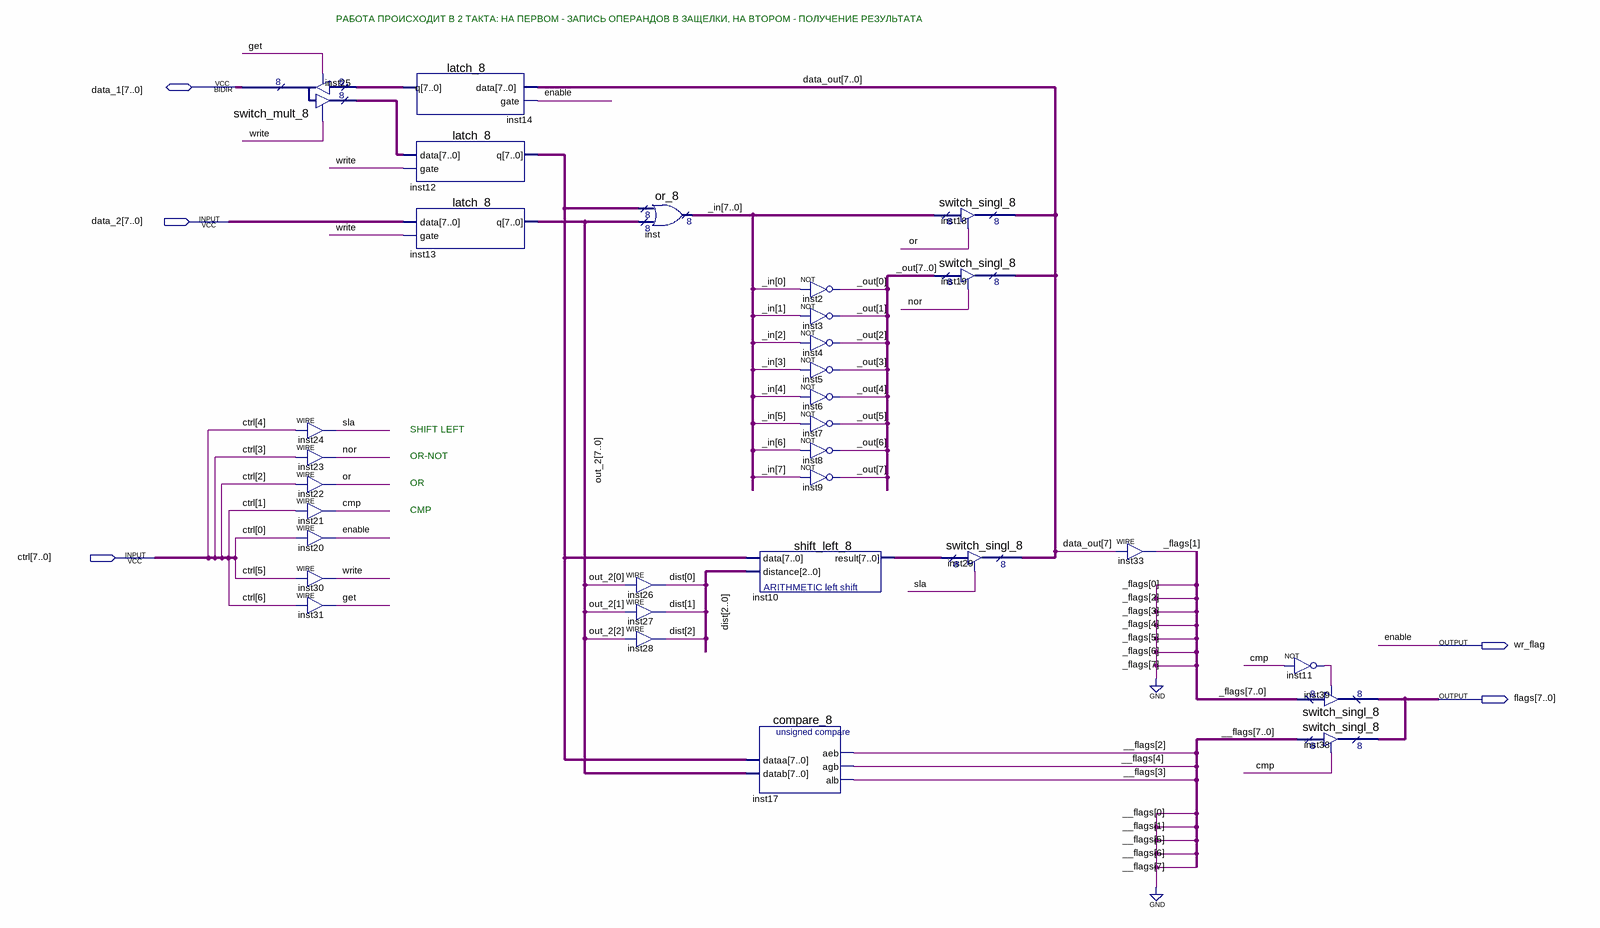
[diagram p0: schematic sheet]
// Quartus schematic alu.bdf as structural Verilog: 32 symbols, 5 pins
module alu (
  input  [7:0] data_2,
  input  [7:0] ctrl,
  inout  [7:0] data_1,
  output wr_flag,
  output [7:0] flags
);

  wire cmp, get, inst11_out, \nor , \or , sla, write;
  wire [1:1] _flags;
  wire [2:0] \dist ;
  wire [4:2] __flags;
  wire [7:0] _in, _out, data_out, inst10_result, inst12_q, inst14_q, inst25_result, out_2;

  switch_mult_8 inst25 (.enabledt(get), .data(inst14_q), .enabletr(write), .result(inst25_result), .tridata(data_1));
  assign sla = ctrl[4];  // WIRE inst24
  assign \nor  = ctrl[3];  // WIRE inst23
  assign \or  = ctrl[2];  // WIRE inst22
  assign cmp = ctrl[1];  // WIRE inst21
  assign wr_flag = ctrl[0];  // WIRE inst20
  assign write = ctrl[5];  // WIRE inst30
  assign get = ctrl[6];  // WIRE inst31
  latch_8 inst14 (.data(data_out), .gate(wr_flag), .q(inst14_q));
  latch_8 inst12 (.data(inst25_result), .gate(write), .q(inst12_q));
  latch_8 inst13 (.data(data_2), .gate(write), .q(out_2));
  assign \dist [0] = out_2[0];  // WIRE inst26
  assign \dist [1] = out_2[1];  // WIRE inst27
  assign \dist [2] = out_2[2];  // WIRE inst28
  or_8 inst (.data0x(inst12_q), .data1x(out_2), .result(_in));
  shift_left_8 inst10 (.data(inst12_q), .distance(\dist ), .result(inst10_result));
  compare_8 inst17 (.dataa(inst12_q), .datab(out_2), .aeb(__flags[2]), .agb(__flags[4]), .alb(__flags[3]));
  not inst2 (_out[0], _in[0]);
  not inst3 (_out[1], _in[1]);
  not inst4 (_out[2], _in[2]);
  not inst5 (_out[3], _in[3]);
  not inst6 (_out[4], _in[4]);
  not inst7 (_out[5], _in[5]);
  not inst8 (_out[6], _in[6]);
  not inst9 (_out[7], _in[7]);
  switch_singl_8 inst18 (.enabledt(\or ), .data(_in), .tridata(data_out));
  switch_singl_8 inst19 (.enabledt(\nor ), .data(_out), .tridata(data_out));
  switch_singl_8 inst29 (.enabledt(sla), .data(inst10_result), .tridata(data_out));
  assign _flags[1] = data_out[7];  // WIRE inst33
  not inst11 (inst11_out, cmp);
  switch_singl_8 inst39 (.enabledt(inst11_out), .data({{6{1'b0}}, _flags[1], 1'b0}), .tridata(flags));
  switch_singl_8 inst38 (.enabledt(cmp), .data({3'b000, __flags, 2'b00}), .tridata(flags));

  // Other names for the same wires on the sheet: enable = wr_flag

  // Notes on the sheet:
  //   РАБОТА ПРОИСХОДИТ В 2 ТАКТА: НА ПЕРВОМ - ЗАПИСЬ ОПЕРАНДОВ В ЗАЩЕЛКИ, НА ВТОРОМ - ПОЛУЧЕНИЕ РЕЗУЛЬТАТА
  //   SHIFT LEFT
  //   OR-NOT
  //   OR
  //   CMP
endmodule
